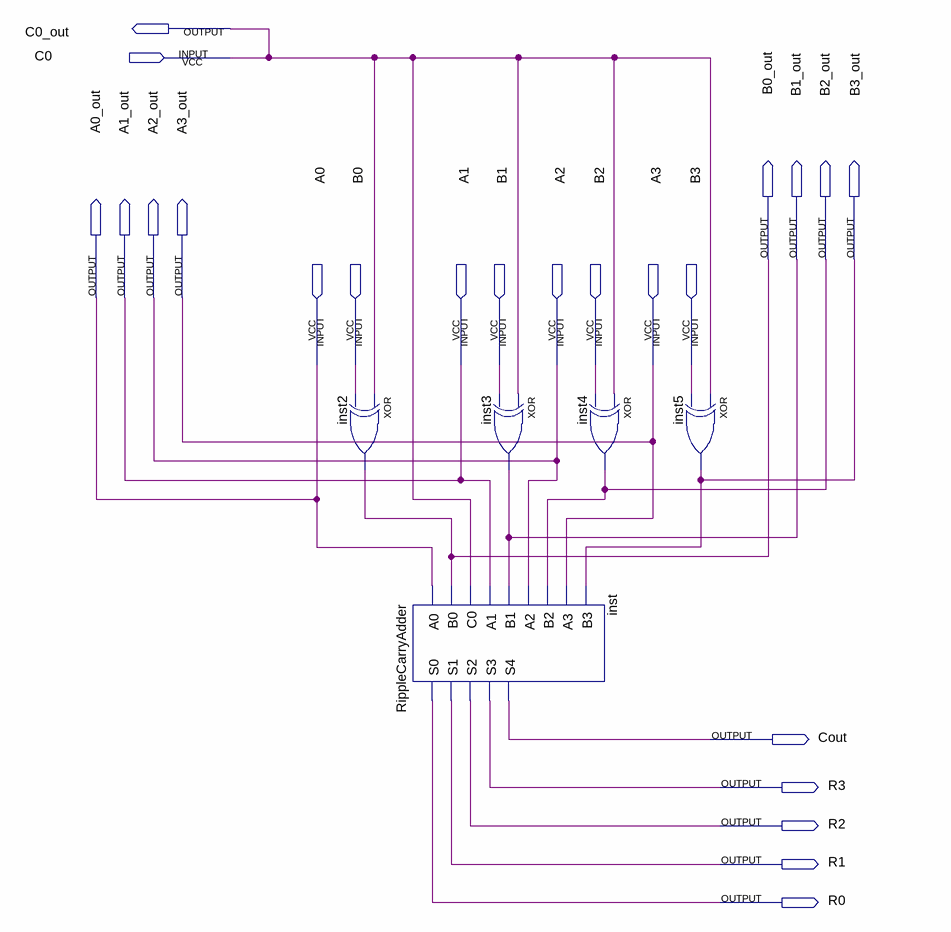
[diagram p0: schematic sheet]
// Quartus schematic Adder_Subtractor.bdf as structural Verilog: 5 symbols, 23 pins
module Adder_Subtractor (
  input  C0,
  input  A0,
  input  B0,
  input  A1,
  input  B1,
  input  A2,
  input  B2,
  input  A3,
  input  B3,
  output C0_out,
  output B0_out,
  output B1_out,
  output B2_out,
  output B3_out,
  output A0_out,
  output A1_out,
  output A2_out,
  output A3_out,
  output Cout,
  output R3,
  output R2,
  output R1,
  output R0
);

  xor inst2 (B0_out, C0, B0);
  RippleCarryAdder inst (
    .A0(A0), .B0(B0_out), .C0(C0), .A1(A1), .B1(B1_out), .A2(A2), .B2(B2_out), .A3(A3), .B3(B3_out), .S0(R0),
    .S1(R1), .S2(R2), .S3(R3), .S4(Cout));
  xor inst3 (B1_out, C0, B1);
  xor inst4 (B2_out, C0, B2);
  xor inst5 (B3_out, C0, B3);

  assign A0_out = A0;
  assign A1_out = A1;
  assign A2_out = A2;
  assign A3_out = A3;
  assign C0_out = C0;
endmodule
